# EAGLE design BSPD_v8 (EAGLE 9.5.1)

## Sheet 1 of 2
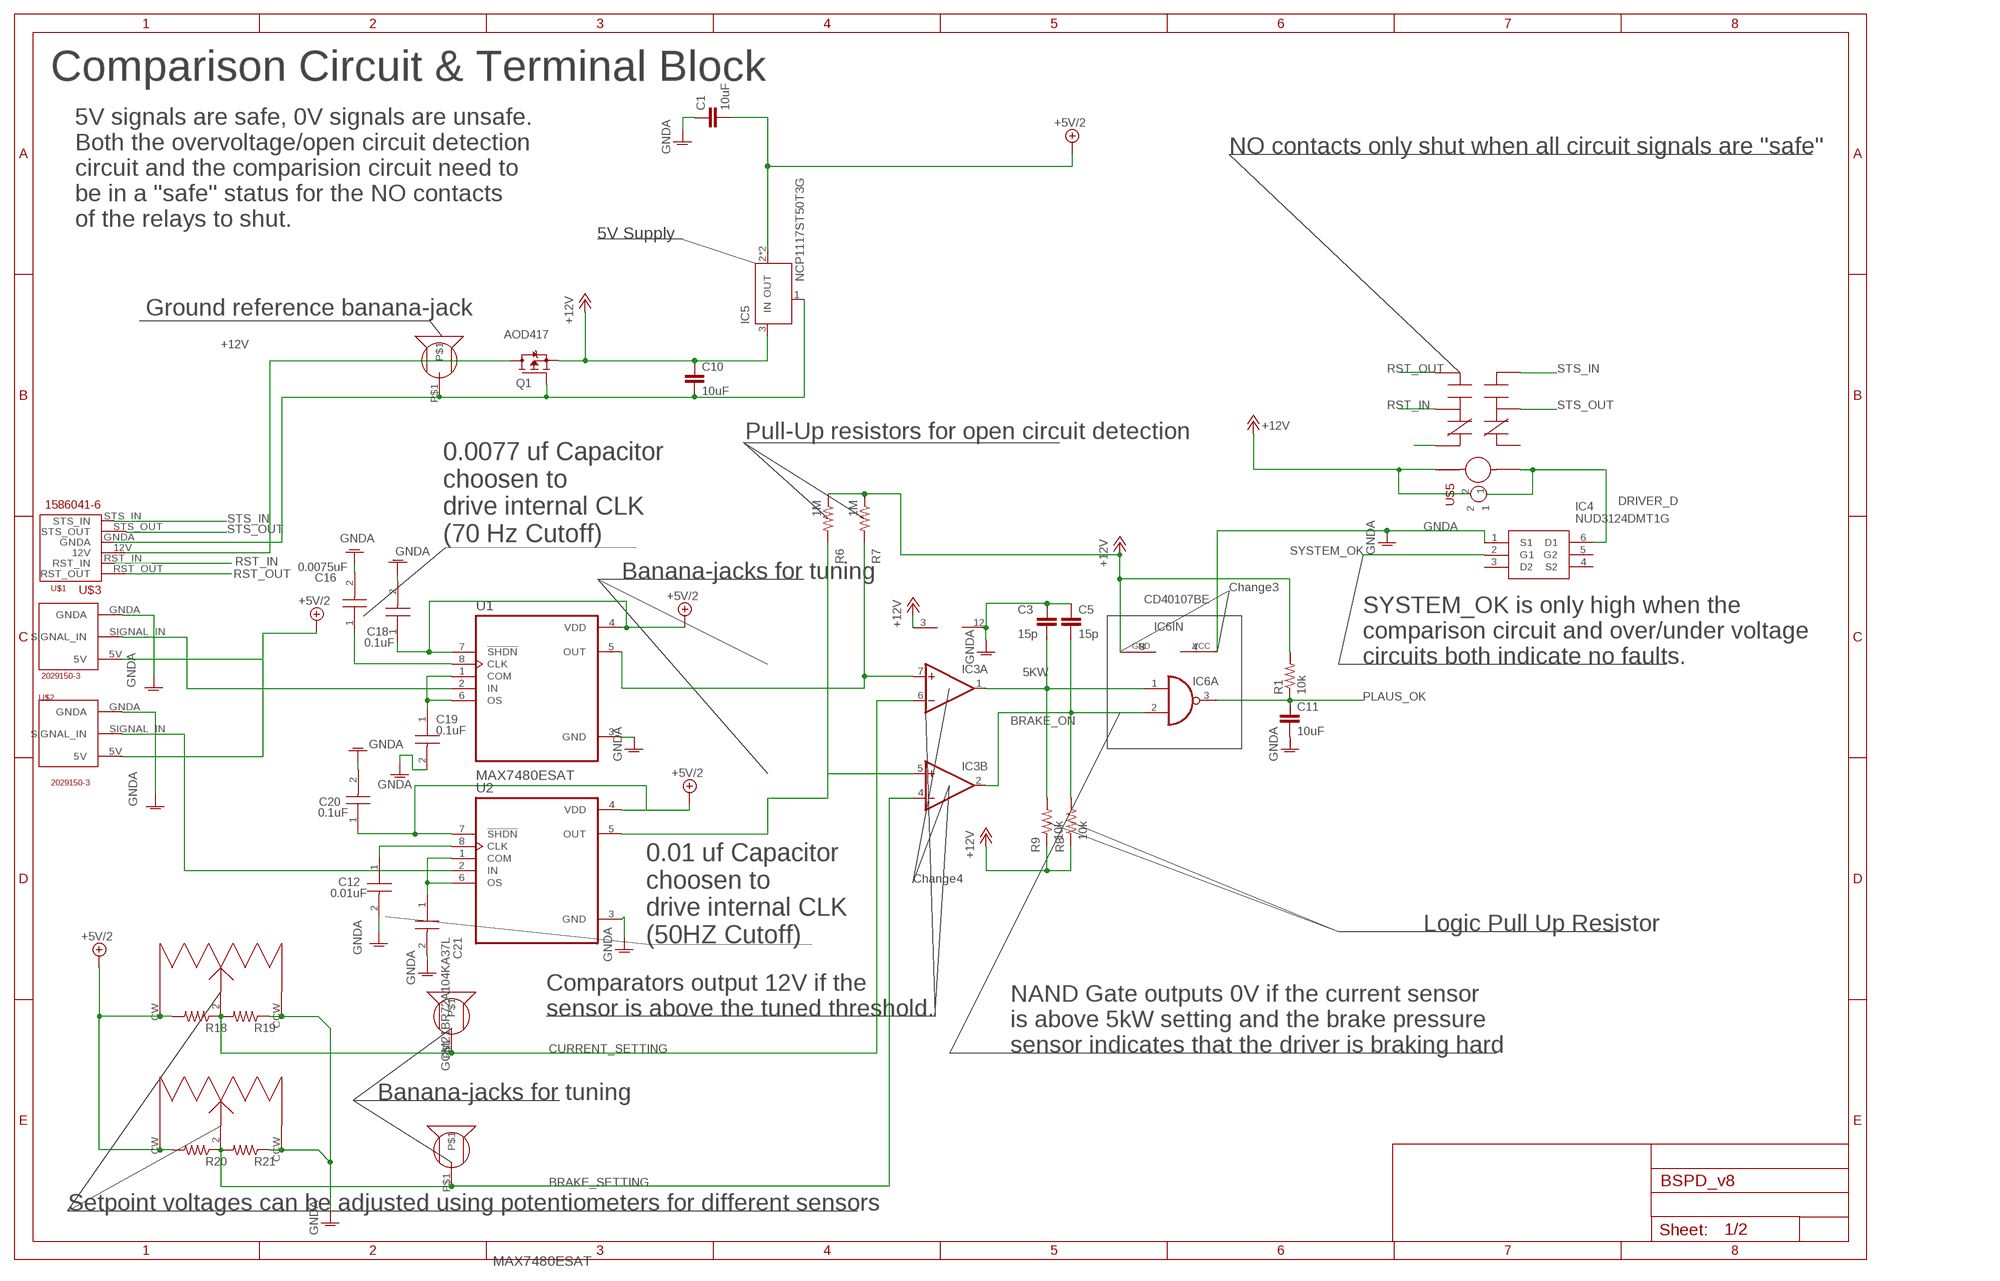
[diagram p0: schematic, sheet 1]

### Parts
C1  10uF  C-EUC0805  [C0805]
C3  15p  C-EUC0805  [C0805]
C5  15p  C-EUC0805  [C0805]
C10  10uF  C-EUC0805  [C0805]
C11  10uF  C-EUC0805  [C0805]
C12  0.01uF  GRM2195C1H103JA01D  [CAPC2012X95N]
C16  0.0075uF  GRM2195C1H752JA01D  [CAPC2012X95N]
C18  0.1uF  GCM21BR72A104KA37L  [CAPC2012X140N]
C19  0.1uF  GCM21BR72A104KA37L  [CAPC2012X140N]
C20  0.1uF  GCM21BR72A104KA37L  [CAPC2012X140N]
C21  GCM21BR72A104KA37L  [CAPC2012X140N]
IC3  4AMP_P11+7N  [DIL14]
IC4  NUD3124DMT1G  [SOT95P275X110-6N]
IC5  NCP1117ST50T3G  [SOT223]
IC6  CD40107BE  [DIL08]
Q1  AOD417  FDD4141TO252  [TO252]
R1  10k  R-US_M0805  [M0805]
R6  1M  R-US_M0805  [M0805]
R7  1M  R-US_M0805  [M0805]
R8  10k  R-US_M0805  [M0805]
R9  10k  R-US_M0805  [M0805]
R18  R-US_M0805  [M0805]
R19  R-US_M0805  [M0805]
R20  R-US_M0805  [M0805]
R21  R-US_M0805  [M0805]
U1  MAX7480ESAT  [SOIC127P600X175-8N]
U2  MAX7480ESAT  [SOIC127P600X175-8N]
U$1  2029150-3  [2029150-3]
U$2  2029150-3  [2029150-3]
U$3  1586041-6  [1586041-6]
U$4  BSPD_PARTS_MP_BANANA_PLUG  [BSPD_PARTS_BANANA_PLUG]
U$5  SSL-LX3044ID-12V  [SSL-LX3044ID-12V]
U$10  POT_3310Y-025-103L  [3310Y]
U$11  POT_3310Y-025-103L  [3310Y]
U$12  BSPD_PARTS_RLY_V23079A1001B301  [BSPD_PARTS_V23079F1101B301]
U$18  BSPD_PARTS_MP_BANANA_PLUG  [BSPD_PARTS_BANANA_PLUG]
U$19  BSPD_PARTS_MP_BANANA_PLUG  [BSPD_PARTS_BANANA_PLUG]

### Nets
5KW: C3.2 IC3.1(A:OUT) IC6.1(A:I0) R9.2
12V: Q1.3(D) U$3.12V
+5V/2: C1.2 C18.1 C20.1 IC5.2(OUT) IC5.4(OUT) R18.2 R20.2 U1.4(VDD) U1.7(!SHDN) U2.4(VDD) U2.7(!SHDN) U$1.5V U$2.5V U$10.CW U$11.CW ; also sheet 2
+12V: C10.1 IC3.3(P:V+) IC5.3(IN) IC6.8(IN:GND) Q1.2(S) R1.2 R6.1 R7.1 R8.1 R9.1 U$5.2 U$12.1 ; also sheet 2
BRAKE_ON: C5.2 IC3.2(B:OUT) IC6.2(A:I1) R8.2
BRAKE_PRES_IN: IC3.5(B:+IN) R6.2 U2.5(OUT) ; also sheet 2
BRAKE_SETTING: IC3.4(B:-IN) R20.1 R21.2 U$10.2(VO) U$19.P$1
CURRENT_IN: IC3.7(A:+IN) R7.2 U1.5(OUT) ; also sheet 2
CURRENT_SETTING: IC3.6(A:-IN) R18.1 R19.2 U$11.2(VO) U$18.P$1
DRIVER_D: IC4.6(D1) U$5.1 U$12.12
GNDA: C1.1 C3.1 C5.1 C10.2 C11.2 C12.2 C16.2 C18.2 C19.2 C20.2 C21.2 IC3.12(P:V-) IC4.1(S1) IC5.1(GND) IC6.4(IN:VCC) Q1.1(G) R19.1 R21.1 U1.3(GND) U2.3(GND) U$1.GNDA U$2.GNDA U$3.GNDA U$4.P$1 U$10.CCW U$11.CCW ; also sheet 2
N$1: U2.2(IN) U$2.SIGNAL_IN
N$2: U1.2(IN) U$1.SIGNAL_IN
N$3: U$12.3
N$4: C19.1 U1.1(COM) U1.6(OS)
N$6: C21.1 U2.1(COM) U2.6(OS)
N$7: C12.1 U2.8(CLK)
N$10: C16.1 U1.8(CLK)
PLAUS_OK: C11.1 IC6.3(A:O) R1.1 ; also sheet 2
RST_IN: U$3.RST_IN U$12.4
RST_OUT: U$3.RST_OUT U$12.5
STS_IN: U$3.STS_IN U$12.8
STS_OUT: U$3.STS_OUT U$12.9
SYSTEM_OK: IC4.2(G1) ; also sheet 2
Unconnected: IC3.8(C:-IN) IC3.9(C:+IN) IC3.10(D:-IN) IC3.11(D:+IN) IC3.13(D:OUT) IC3.14(C:OUT) IC4.3(D2) IC4.4(S2) IC4.5(G2) IC6.5(B:O) IC6.6(B:I0) IC6.7(B:I1) U$12.10

### Notes on the sheet
- Comparison Circuit & Terminal Block
- NO contacts only shut when all circuit signals are "safe"
- 5V signals are safe, 0V signals are unsafe.
  Both the overvoltage/open circuit detection
  circuit and the comparision circuit need to
  be in a "safe" status for the NO contacts
  of the relays to shut.
- 5V Supply
- Ground reference banana-jack
- Pull-Up resistors for open circuit detection
- 0.0077 uf Capacitor
  choosen to 
  drive internal CLK
  (70 Hz Cutoff)
- Banana-jacks for tuning
- Change3
- SYSTEM_OK is only high when the
  comparison circuit and over/under voltage 
  circuits both indicate no faults.
- Change4
- Logic Pull Up Resistor
- 0.01 uf Capacitor
  choosen to 
  drive internal CLK
  (50HZ Cutoff)
- Comparators output 12V if the 
  sensor is above the tuned threshold.
- NAND Gate outputs 0V if the current sensor
  is above 5kW setting and the brake pressure
  sensor indicates that the driver is braking hard
- Banana-jacks for tuning
- Setpoint voltages can be adjusted using potentiometers for different sensors

## Sheet 2 of 2
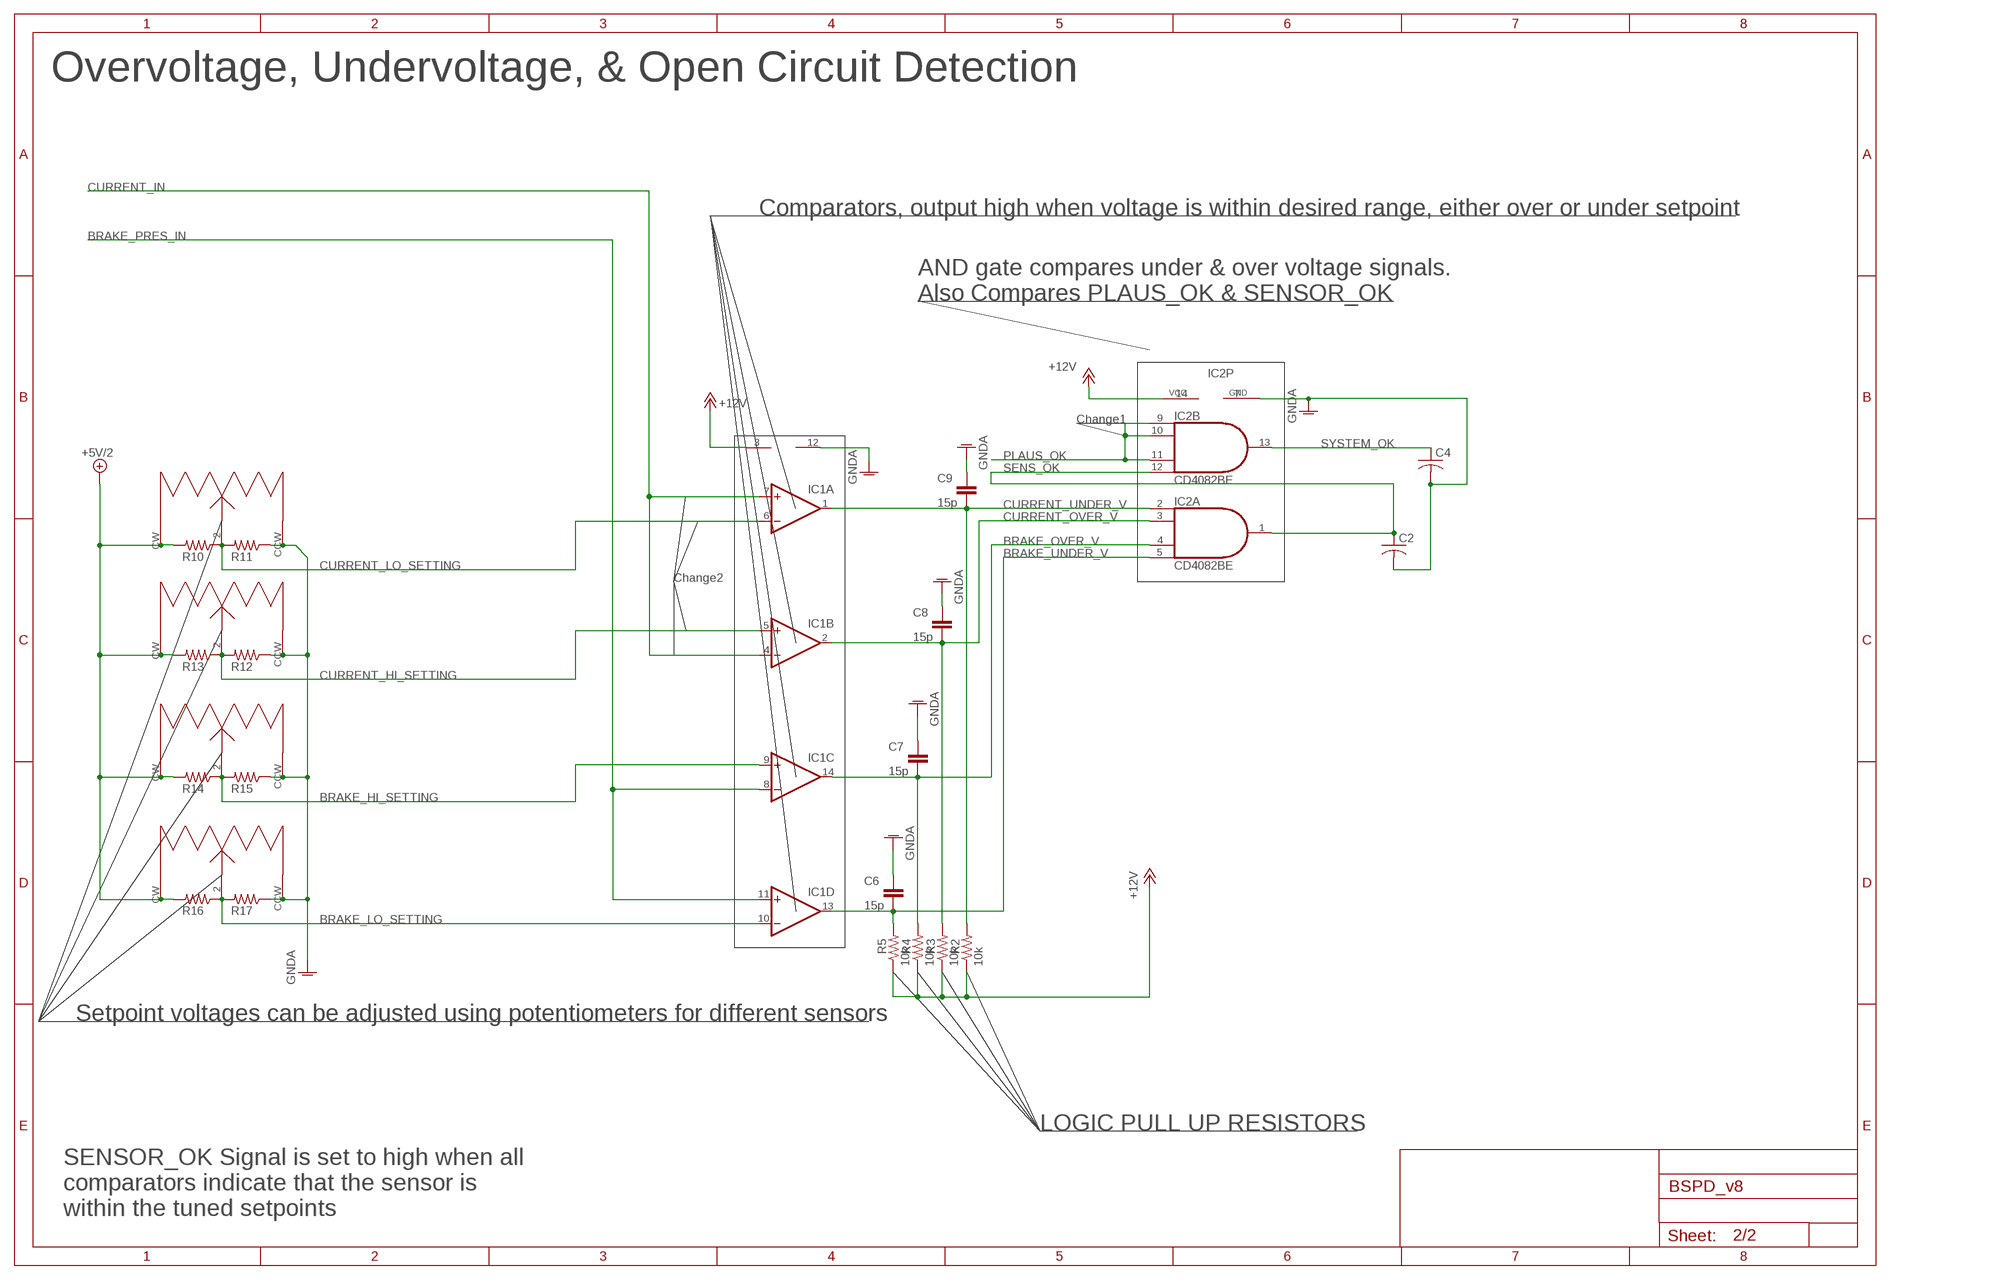
[diagram p1: schematic, sheet 2]

### Parts
C2  C-USC0805  [C0805]
C4  C-USC0805  [C0805]
C6  15p  C-EUC0805  [C0805]
C7  15p  C-EUC0805  [C0805]
C8  15p  C-EUC0805  [C0805]
C9  15p  C-EUC0805  [C0805]
IC1  4AMP_P11+7N  [DIL14]
IC2  CD4082BE  74ALS21N  [DIL14]
R2  10k  R-US_M0805  [M0805]
R3  10k  R-US_M0805  [M0805]
R4  10k  R-US_M0805  [M0805]
R5  10k  R-US_M0805  [M0805]
R10  R-US_M0805  [M0805]
R11  R-US_M0805  [M0805]
R12  R-US_M0805  [M0805]
R13  R-US_M0805  [M0805]
R14  R-US_M0805  [M0805]
R15  R-US_M0805  [M0805]
R16  R-US_M0805  [M0805]
R17  R-US_M0805  [M0805]
U$6  POT_3310Y-025-103L  [3310Y]
U$7  POT_3310Y-025-103L  [3310Y]
U$8  POT_3310Y-025-103L  [3310Y]
U$9  POT_3310Y-025-103L  [3310Y]

### Nets
+5V/2: R10.2 R13.2 R14.2 R16.2 U$6.CW U$7.CW U$8.CW U$9.CW ; also sheet 1
+12V: IC1.3(P:V+) IC2.14(P:VCC) R2.1 R3.1 R4.1 R5.1 ; also sheet 1
BRAKE_HI_SETTING: IC1.9(C:+IN) R14.1 R15.2 U$8.2(VO)
BRAKE_LO_SETTING: IC1.10(D:-IN) R16.1 R17.2 U$9.2(VO)
BRAKE_OVER_V: C7.2 IC1.14(C:OUT) IC2.4(A:I2) R4.2
BRAKE_PRES_IN: IC1.8(C:-IN) IC1.11(D:+IN) ; also sheet 1
BRAKE_UNDER_V: C6.2 IC1.13(D:OUT) IC2.5(A:I3) R5.2
CURRENT_HI_SETTING: IC1.5(B:+IN) R12.2 R13.1 U$7.2(VO)
CURRENT_IN: IC1.4(B:-IN) IC1.7(A:+IN) ; also sheet 1
CURRENT_LO_SETTING: IC1.6(A:-IN) R10.1 R11.2 U$6.2(VO)
CURRENT_OVER_V: C8.2 IC1.2(B:OUT) IC2.3(A:I1) R3.2
CURRENT_UNDER_V: C9.2 IC1.1(A:OUT) IC2.2(A:I0) R2.2
GNDA: C2.2 C4.2 C6.1 C7.1 C8.1 C9.1 IC1.12(P:V-) IC2.7(P:GND) R11.1 R12.1 R15.1 R17.1 U$6.CCW U$7.CCW U$8.CCW U$9.CCW ; also sheet 1
PLAUS_OK: IC2.9(B:I0) IC2.10(B:I1) IC2.11(B:I2) ; also sheet 1
SENS_OK: C2.1 IC2.1(A:O) IC2.12(B:I3)
SYSTEM_OK: C4.1 IC2.13(B:O) ; also sheet 1

### Notes on the sheet
- Overvoltage, Undervoltage, & Open Circuit Detection
- Comparators, output high when voltage is within desired range, either over or under setpoint
- AND gate compares under & over voltage signals.
  Also Compares PLAUS_OK & SENSOR_OK
- Change1
- Change2
- Setpoint voltages can be adjusted using potentiometers for different sensors
- LOGIC PULL UP RESISTORS
- SENSOR_OK Signal is set to high when all 
  comparators indicate that the sensor is 
  within the tuned setpoints

## Library data of the parts
C1 C10 C11 = resistor:C-EU: CAPACITOR, European symbol
C2 C4 = rcl:C-US: CAPACITOR, American symbol; SPICEPREFIX: C
C3 C5-C9 = rcl:C-EU: CAPACITOR, European symbol; SPICEPREFIX: C
C12 = SamacSys_Parts:GRM2195C1H103JA01D: Murata 0805 GRM 10nF Ceramic Multilayer Capacitor, 50 V dc, +125C, C0G Dielectric, +/-5% SMD Source: Datasheet <https://componentsearchengine.com/Datasheets/1/GRM2195C1H103JA01D.pdf>; DESCRIPTION: Murata 0805 GRM 10nF Ceramic Multilayer Capacitor, 50 V dc, +125C, C0G Dielectric, +/-5% SMD; HEIGHT: 0.95mm; MANUFACTURER_NAME: Murata Electronics; MANUFACTURER_PART_NUMBER: GRM2195C1H103JA01D; MOUSER_PART_NUMBER: 81-GRM215C1H103JA01D; MOUSER_PRICE-STOCK: https://www.mouser.com/Search/Refine.aspx?Keyword=81-GRM215C1H103JA01D
C16 = SamacSys_Parts:GRM2195C1H752JA01D: Murata 0805 GRM 7.5nF Ceramic Multilayer Capacitor, 50 V, +125C, C0G Dielectric, +/-5% SMD Source: Datasheet <https://componentsearchengine.com/Datasheets/1/GRM2195C1H752JA01D.pdf>; DESCRIPTION: Murata 0805 GRM 7.5nF Ceramic Multilayer Capacitor, 50 V, +125C, C0G Dielectric, +/-5% SMD; HEIGHT: 0.95mm; MANUFACTURER_NAME: Murata Electronics; MANUFACTURER_PART_NUMBER: GRM2195C1H752JA01D; MOUSER_PART_NUMBER: 81-GRM2195C1H752JA1D; MOUSER_PRICE-STOCK: https://www.mouser.com/Search/Refine.aspx?Keyword=81-GRM2195C1H752JA1D
C18-C21 = SamacSys_Parts:GCM21BR72A104KA37L: Ceramic SMT capacitor 100nF 100Vdc Murata 100nF Multilayer Ceramic Capacitor (MLCC) 100 V dc +/-10% X7R dielectric GCM Surface Mount max op. temp. +125C Source: Datasheet <https://componentsearchengine.com/Datasheets/1/GCM21BR72A104KA37L.pdf>; DESCRIPTION: Ceramic SMT capacitor 100nF 100Vdc Murata 100nF Multilayer Ceramic Capacitor (MLCC) 100 V dc +/-10% X7R dielectric GCM Surface Mount max op. temp. +125C; HEIGHT: 1.4mm; MANUFACTURER_NAME: Murata Electronics; MANUFACTURER_PART_NUMBER: GCM21BR72A104KA37L; MOUSER_PART_NUMBER: 81-GCM21BR72A104KA7L; MOUSER_PRICE-STOCK: https://www.mouser.com/Search/Refine.aspx?Keyword=81-GCM21BR72A104KA7L
IC1 IC3 = BSPD_REV6:4AMP_P11+7: OP AMP
IC2 = BSPD_REV6:74*21: Dual 4-input AND gate
IC4 = SamacSys_Parts:NUD3124DMT1G: Automotive Inductive Load Driver Source: Datasheet <https://componentsearchengine.com/Datasheets/1/NUD3124DMT1G.pdf>; DESCRIPTION: Automotive Inductive Load Driver; HEIGHT: 1.1mm; MANUFACTURER_NAME: ON Semiconductor; MANUFACTURER_PART_NUMBER: NUD3124DMT1G; MOUSER_PART_NUMBER: 863-NUD3124DMT1G
IC5 = BSPD_REV6:NCP1117ST50T3G
IC6 = BSPD_REV6:CD40107BE
Q1 = AOD417:FDD4141: P-Channel PowerTrench® MOSFET Source: FDD4141.pdf; AVAILABILITY: Unavailable; DESCRIPTION: Transistor: P-MOSFET; unipolar; -40V; -50A; 69W; DPAK; MF: ON Semiconductor; MP: FDD4141; PACKAGE: TO-252-3 Fairchild Semiconductor; PRICE: None
R1 = rcl:R-US_: RESISTOR, American symbol; SPICEPREFIX: R
R2-R21 = resistor:R-US_: RESISTOR, American symbol
U1 U2 = MAX7480ESAT:MAX7480ESAT; DESCRIPTION: Active Filter Single SW-CAP Low Pass 8th Order 2kHz 8-Pin SOIC N; DIGI-KEY_PART_NUMBER: MAX7480ESA+-ND; DIGI-KEY_PURCHASE_URL: https://www.digikey.com/product-detail/en/maxim-integrated/MAX7480ESA-/MAX7480ESA--ND/1513397?utm_source=snapeda&utm_medium=aggregator&utm_campaign=symbol; MF: Maxim Integrated; MP: MAX7480ESA+; PACKAGE: SOIC-8 Maxim
U$1 U$2 = WM21358-ND:2029150-3
U$3 = WM21358-ND:1586041-6
U$4 U$18 U$19 = BSPD_v4:BSPD_PARTS_MP_BANANA_PLUG
U$5 = 67-1067-ND:SSL-LX3044ID-12V
U$6-U$11 = BSPD_PARTS:POT_3310Y-025-103L
U$12 = BSPD_v4:BSPD_PARTS_RLY_V23079A1001B301

## Net classes
0 default: width 0.3 mm, drill 0.2 mm, clearance 0.2 mm

## Board
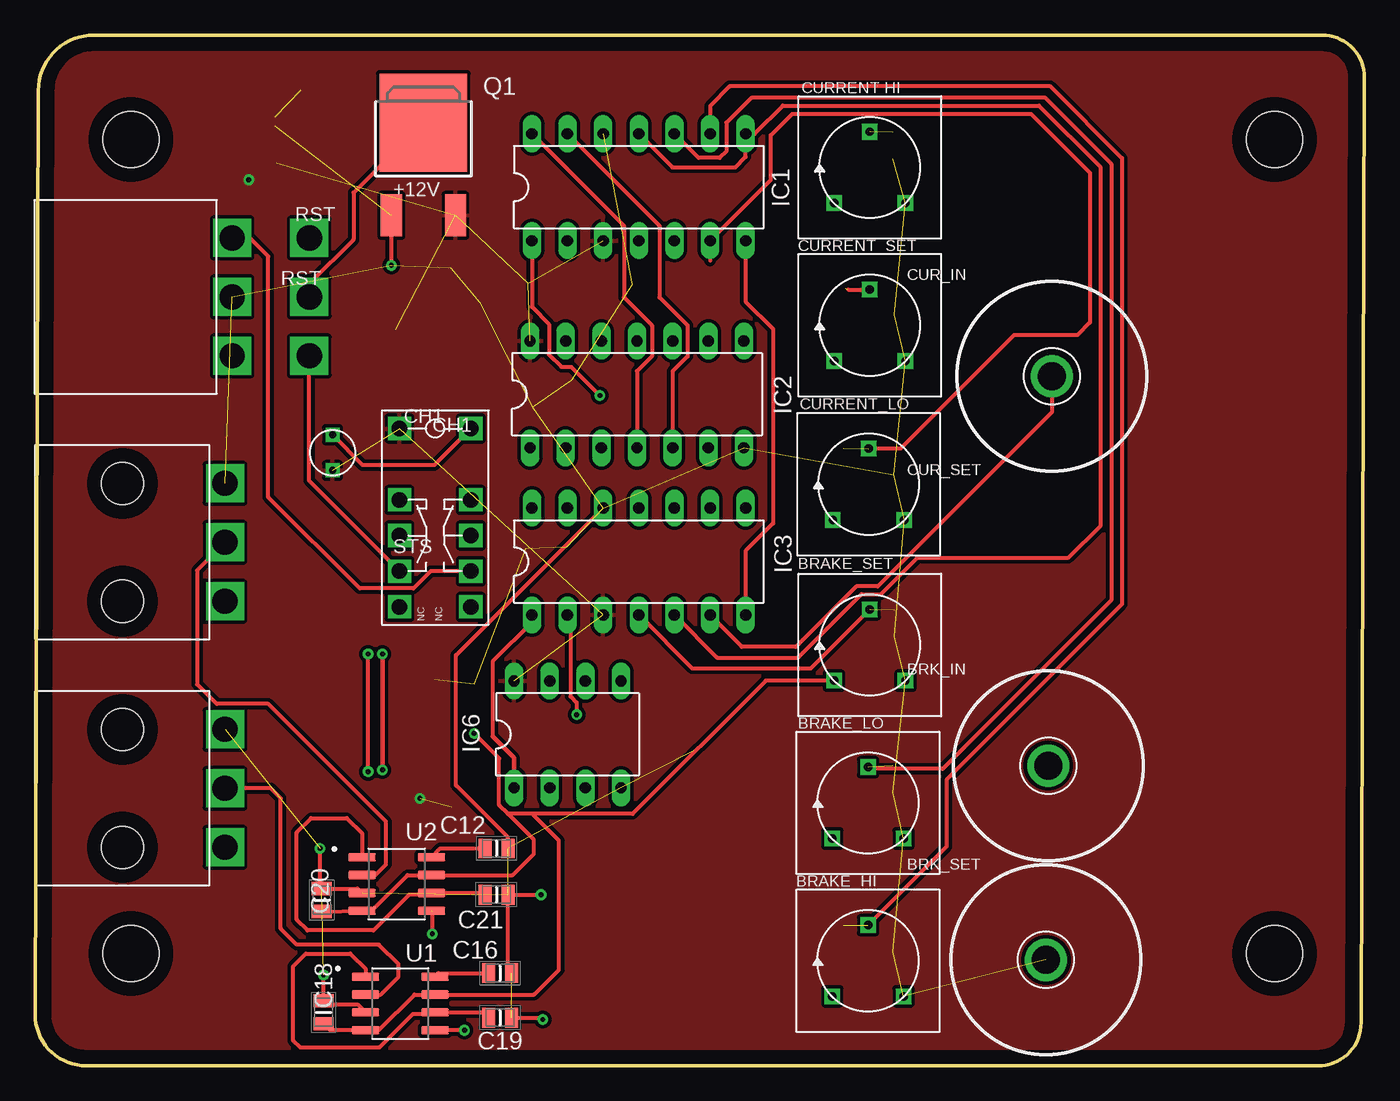
[diagram p2: board, top side]
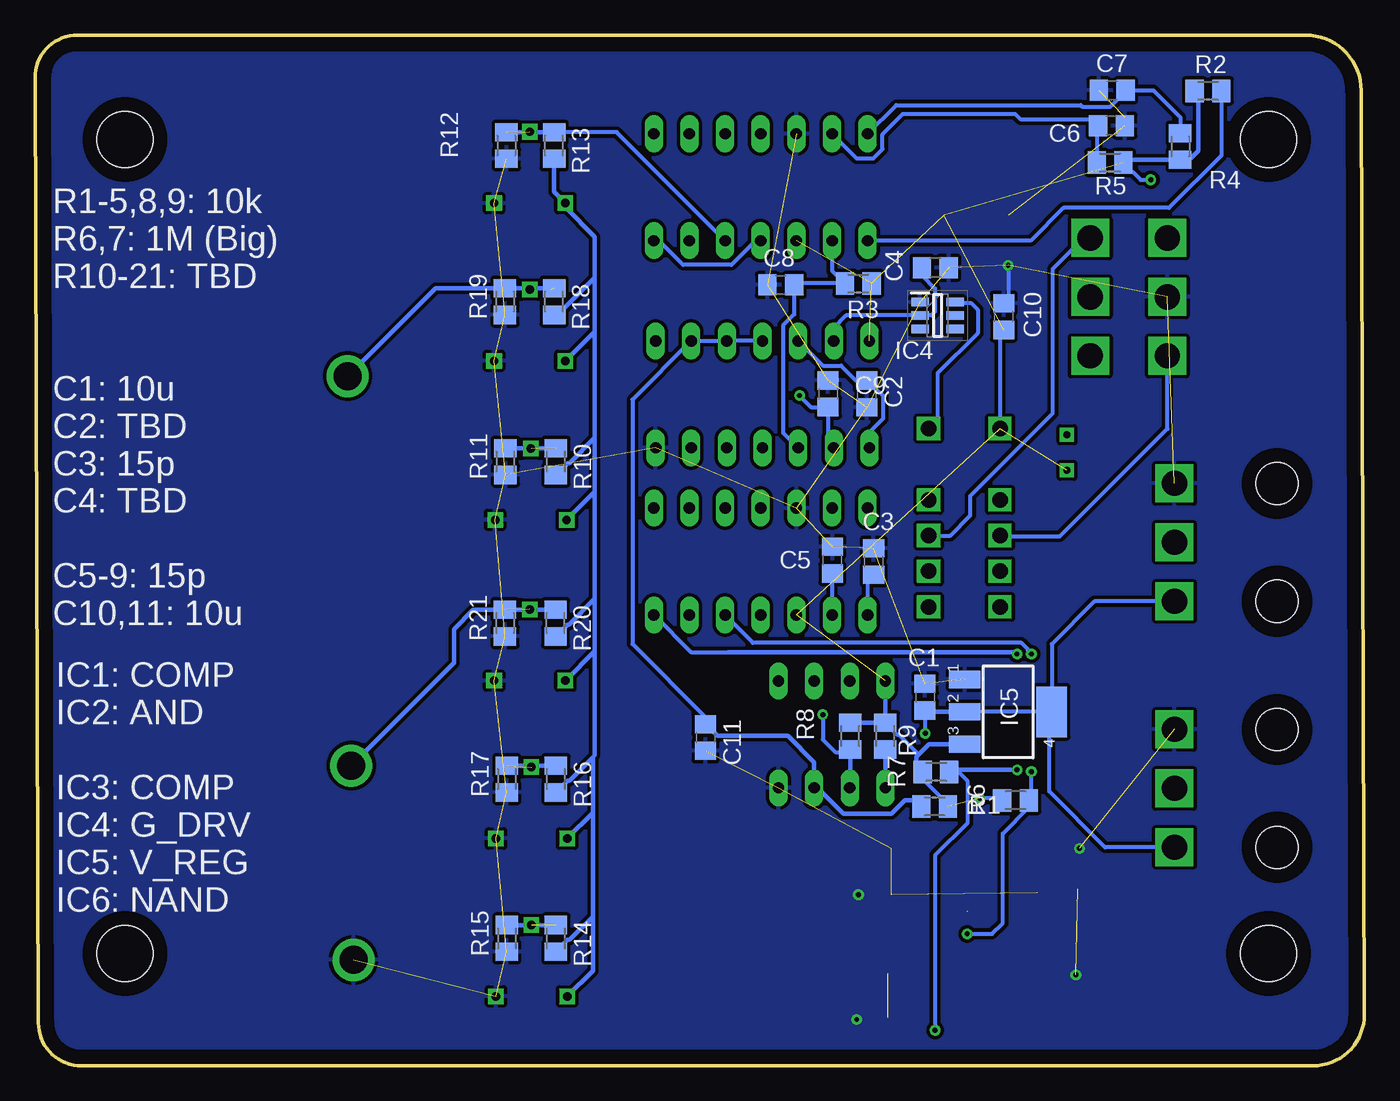
[diagram p3: board, bottom side, seen from below]

Size 94.73 x 73.43 mm. Coordinates in mm from the lower left corner, seen from the top.
Outline: 91.71,73.43 4.19,73.43 arc90 0.23,69.48 0,3.67 arc90 3.66,0 91.42,0 arc90 94.5,3.06 94.73,70.4 arc90 91.71,73.43
Copper layers (1*16): Top 0.035mm / dielectric 1.5mm / Bottom 0.035mm
Design rules "default *": minimum track width 6mil, minimum drill 0.35mm, track to track 10mil, track to pad 10mil, pad to pad 10mil, via to via 10mil, smd to smd 10mil, copper to edge 40mil, drill to drill 10mil, minimum pad ring 10mil, minimum via ring 8mil, stop-mask expansion 4mil, vias tented up to drill 0mil, thermal gap 10mil
Holes 4 mm at 6.84,66 6.84,8 88.34,66 88.34,8

### Footprints (pad centres in the part's own frame; a part is rotated, then mirrored left to right if it is on the bottom)
C0805 = smd 1.3 x 1.5: 1 -0.95,0; 2 0.95,0
CAPC2012X95N = smd 0.91 x 1.39: 1 -0.82,0; 2 0.82,0
CAPC2012X140N = smd 0.94 x 1.43: 1 -0.82,0; 2 0.82,0
DIL14 = drill 0.813 long: 1 -7.62,-3.81; 2 -5.08,-3.81; 3 -2.54,-3.81; 4 0,-3.81; 5 2.54,-3.81; 6 5.08,-3.81; 7 7.62,-3.81; 8 7.62,3.81; 9 5.08,3.81; 10 2.54,3.81; 11 0,3.81; 12 -2.54,3.81; 13 -5.08,3.81; 14 -7.62,3.81
SOT95P275X110-6N = smd 1.25 x 0.6: 1 -1.25,0.95; 2 -1.25,0; 3 -1.25,-0.95; 4 1.25,-0.95; 5 1.25,0; 6 1.25,0.95
SOT223 = smd 1.219 x 2.235: 1 -2.311,-3.099; 2 0,-3.099; 3 2.311,-3.099 | smd 3.6 x 2.2: 4 0,3.099
DIL08 = drill 0.813 long: 1 -3.81,-3.81; 2 -1.27,-3.81; 3 1.27,-3.81; 4 3.81,-3.81; 5 3.81,3.81; 6 1.27,3.81; 7 -1.27,3.81; 8 -3.81,3.81
TO252 = smd 1.5 x 3: 1 -2.286,-6.6; 2 2.28,-6.6 | smd 6.25 x 7: 3 0,0
M0805 = smd 1.3 x 1.6: 1 -0.95,0; 2 0.95,0
SOIC127P600X175-8N = smd 1.97 x 0.59: 1 -2.475,1.905; 2 -2.475,0.635; 3 -2.475,-0.635; 4 -2.475,-1.905; 5 2.475,-1.905; 6 2.475,-0.635; 7 2.475,0.635; 8 2.475,1.905
2029150-3 = drill 1.8 square: 5V 11.1,13.55; GNDA 2.7,13.55; SIGNAL_IN 6.9,13.55 | hole 3: 2.7,6.25; 11.1,6.25
1586041-6 = drill 1.8 square: 12V 6.9,-6.6; GNDA 6.9,-1.1; RST_IN 2.7,-1.1; RST_OUT 2.7,-6.6; STS_IN 11.1,-1.1; STS_OUT 11.1,-6.6
BSPD_PARTS_BANANA_PLUG = drill 2 pad 3: P$1 0,0
SSL-LX3044ID-12V = drill 0.5 square: 1 1.27,0; 2 -1.27,0
3310Y = drill 0.6 square: 2 2.54,5.08; CCW 5.08,0; CW 0,0
BSPD_PARTS_V23079F1101B301 = drill 1.1 square: 1 0,0; 3 5.08,0; 4 7.62,0; 5 10.16,0; 6 12.7,0; 7 12.7,5.08; 8 10.16,5.08; 9 7.62,5.08; 10 5.08,5.08; 12 0,5.08

### Placement (x,y rotation side)
C1  31.31,26.27 270 bottom
C2  35.46,47.87 270 bottom
C3  34.97,35.93 270 bottom
C4  30.58,56.85 0 bottom
C5  37.92,36.03 270 bottom
C6  18.02,66.98 180 bottom
C7  17.97,69.49 0 bottom
C8  41.59,55.63 0 bottom
C9  38.21,47.88 270 bottom
C10  25.7,53.38 90 bottom
C11  46.95,23.39 270 bottom
C12  32.88,15.49 0 top
C16  33.13,6.6 0 top
C18  20.56,3.81 90 top
C19  33.13,3.43 0 top
C20  20.43,11.81 90 top
C21  32.88,12.19 0 top
IC1  43.02,62.59 0 top
IC2  42.89,47.84 0 top
IC3  43.02,35.93 0 top
IC4  30.42,53.45 0 bottom
IC5  25.39,25.21 270 bottom
IC6  37.94,23.62 0 top
Q1  27.67,67.18 0 top
R1  30.62,18.47 0 bottom
R2  11.15,69.45 0 bottom
R3  36.07,55.73 180 bottom
R4  13.12,65.49 90 bottom
R5  18.12,64.35 180 bottom
R6  24.86,18.92 0 bottom
R7  30.53,20.94 0 bottom
R8  36.64,23.49 270 bottom
R9  34.14,23.49 270 bottom
R10  57.62,43.04 270 bottom
R11  61.22,43.04 90 bottom
R12  61.14,65.56 90 bottom
R13  57.74,65.56 270 bottom
R14  57.62,9.08 270 bottom
R15  61.12,9.08 90 bottom
R16  57.62,20.42 270 bottom
R17  61.12,20.42 90 bottom
R18  57.74,54.44 270 bottom
R19  61.24,54.44 90 bottom
R20  57.64,31.54 270 bottom
R21  61.24,31.54 90 bottom
U1  26.02,4.45 0 top
U2  25.77,12.95 0 top
U$1  -0.01,26.67 270 top
U$2  -0.01,44.2 270 top
U$3  12.94,47.88 90 top
U$4  72.04,7.54 0 top
U$5  21.2,43.69 90 top
U$6  56.86,38.89 0 top
U$7  56.94,61.46 0 top
U$8  56.82,4.95 0 top
U$9  56.82,16.2 0 top
U$10  56.94,27.44 0 top
U$11  56.94,50.22 0 top
U$12  25.97,45.4 270 top
U$18  72.45,49.13 0 top
U$19  72.2,21.39 0 top

### Tracks (layer width: path | path; a pad name or v marks a point on that pad's centre or on a via)
5KW
  Top 0.3: IC3.1 35.4,31.6 32.61,28.81 32.61,23.48
  Top 0.305: 32.61,23.48 34.13,21.95 IC6.1
  Bottom 0.3: C3.2 35.4,34.55 IC3.1
  Bottom 0.305: R9.2 IC6.1
12V
  Top 0.3: Q1.3 22.69,62.2 22.69,58.86 19.54,55.71 U$3.12V
+5V/2  (via drill 0.35)
  Top 0.3: U$10.CW 52.07,27.44 42.58,17.96 35.42,17.96 | 33.69,17.96 33.07,18.58 33.07,21.91 v31.29,23.69 | 35.42,17.96 33.69,17.96 | 33.69,17.96 35.55,16.1 35.55,15.11 34.02,13.59 U2.7 26.53,13.59 23.99,11.05 U2.4 C20.1 | C18.1 21.01,2.54 U1.4 24.5,2.54 27.04,5.08 U1.7 35.55,5.08 37.33,6.86 37.33,16.05 35.42,17.96
  Bottom 0.3: v31.29,23.69 31.29,25.3 C1.2 | 22.47,25.21 IC5.4 22.29,30.04 19.23,33.1 U$2.5V | 22.47,25.21 IC5.2 | U$1.5V 18.49,15.57 22.47,19.55 22.47,25.21
  Bottom 0.305: R13.2 57.74,62.26 U$7.CW 56.94,61.15 54.85,59.05 54.85,56.13 | 54.85,56.13 54.85,52.31 | 54.85,52.31 54.85,44.73 | 57.59,53.34 R18.2 57.49,53.49 54.85,56.13 | IC5.2 31.2,25.21 C1.2 | R10.2 56.77,42.94 56.65,42.94 54.85,44.73 | R20.2 56.8,31.44 56.67,31.44 54.85,33.26 | 54.85,44.73 54.85,40.89 | 54.85,40.89 54.85,33.26 | R16.2 56.77,20.32 56.65,20.32 54.99,21.98 | 54.85,33.26 54.85,29.53 | 54.85,29.53 54.85,22.11 54.99,21.98 | R14.2 56.77,8.97 56.65,8.97 54.99,10.63 | 54.99,21.98 54.99,18.03 | 54.99,18.03 54.99,10.63 | U$11.CW 54.85,52.31 | U$6.CW 54.85,40.89 | U$10.CW 54.85,29.53 | U$9.CW 54.99,18.03 | U$8.CW 54.99,6.78 54.99,10.63
+12V  (via drill 0.35)  (9 unrouted)
  Bottom 0.3: 13.12,64.66 R4.1 | 16.99,64.54 R5.1 15.94,63.12 v15.23,63.12 | C10.1 25.97,52.16 U$12.1 | R1.2 29.67,18.64 31.48,20.45 R7.1 | R9.1 33.3,23.6 33.18,23.6 31.91,22.33 31.91,21.36 | R6.1 25.94,19.05 v27.42,19.05
  Bottom 0.305: 16.99,64.54 R4.1 12.49,64.54 11.85,65.18 11.85,68.94 12.1,69.19 R2.1 | IC6.8 34.13,24.45 R9.1 R8.1 | R7.1 31.91,21.36 31.91,22.03 31.04,22.9 IC5.3
  pour Top: 0.03,72.92 104.72,72.92 104.31,-1.01 2.23,-1.01 0.03,2.89
BRAKE_HI_SETTING  (1 unrouted)
  Top 0.3: U$8.2 64.94,15.62 64.94,20.38 77.46,32.89 77.46,64.66 72.35,69.77 49.5,69.77 48.1,68.37 IC1.9
  Bottom 0.305: R14.1 R15.2
BRAKE_LO_SETTING  (1 unrouted)
  Top 0.3: U$9.2 59.48,21.15 64.69,21.15 76.7,33.15 76.7,64.26 72,68.96 51.04,68.96 49.26,67.19 49.26,65.15 48.79,64.67 47.29,64.67 IC1.10
  Bottom 0.305: R16.1 R17.2
BRAKE_ON  (via drill 0.35)
  Top 0.3: v38.6,25.02 38.6,25.88 38.15,26.33 38.15,31.91 IC3.2
  Bottom 0.3: C5.2 37.94,35.06 IC3.2 | 36.64,22.35 37.71,22.35 38.6,23.24 v38.6,25.02
  Bottom 0.305: R8.2 36.64,22.35 36.64,19.84 IC6.2
BRAKE_OVER_V
  Top 0.3: IC1.14 41.96,59.84 41.96,54.75 43.96,52.75 43.96,50.55 42.89,49.48 IC2.4
  Bottom 0.3: R4.2 13.12,67.58 15.03,69.49 C7.2 17.02,69.42 18.11,68.34 20.12,68.34 20.23,68.44 33.36,68.44 IC1.14
BRAKE_PRES_IN  (via drill 0.35)  (1 unrouted)
  Top 0.3: v23.74,20.95 v23.74,29.34 | IC1.11 45.41,64.01 49.9,64.01 50.64,64.75 IC1.8 51.27,66.4 53.28,68.41 71.53,68.41 75.93,64.01 75.93,38.48 73.65,36.2 62.87,36.2 60.29,33.61 58.89,33.61 54.36,29.08 48.59,29.08 IC3.5 | 28.31,10.98 v28.31,9.4
  Bottom 0.3: v23.74,20.95 23.74,19.09 R6.2 23.91,18.41 25.77,16.55 25.77,10.16 26.53,9.4 v28.31,9.4 | v23.74,29.34 23.97,29.57 23.97,29.66 24.45,30.14 43.58,30.14 IC3.5
BRAKE_SETTING  (1 unrouted)
  Top 0.3: IC3.4 46.82,28.32 55.28,28.32 U$10.2
  Bottom 0.305: R20.1 R21.2 63.51,32.49 64.88,31.11 64.88,28.7 U$19.P$1
BRAKE_UNDER_V
  Top 0.3: IC1.13 44.5,59.84 44.5,54.75 46.5,52.75 46.5,50.55 45.43,49.48 IC2.5
  Bottom 0.3: R5.2 19.07,66.88 C6.2 19.43,67.44 24.53,67.44 24.9,67.81 32.89,67.81 34.34,66.36 34.34,65.3 34.99,64.64 36.18,64.64 IC1.13
CURRENT_HI_SETTING  (1 unrouted)
  Bottom 0.3: IC1.5 53.29,66.51 R13.1
  Bottom 0.305: R13.1 R12.2
CURRENT_IN  (via drill 0.35)
  Top 0.3: IC1.7 50.64,54.45 52.59,52.49 52.59,38.64 50.64,36.68 IC3.7 | v30.59,2.54 U1.5
  Top 0.305: v24.75,29.34 v24.75,21.08
  Bottom 0.3: R7.2 28.92,20.94 28.31,20.32 28.31,17.27 30.59,14.99 v30.59,2.54 | IC1.4 43.39,58.78 45.12,57.05 48.54,57.05 50.27,58.78 IC1.7 | IC3.7 47.99,29.46 45.32,29.46
  Bottom 0.305: 45.32,29.46 24.88,29.46 v24.75,29.34 | v24.75,21.08 29.44,21.08 R7.2
CURRENT_LO_SETTING  (1 unrouted)
  Top 0.3: 48.11,57.37 48.11,58.77 IC1.6 52.44,63.12 52.44,66.29 53.96,67.82 70.97,67.82 75.17,63.62 75.17,52.96 74.27,52.05 69.76,52.05 61.67,43.97 U$6.2
  Bottom 0.305: R10.1 R11.2
CURRENT_OVER_V
  Bottom 0.3: IC2.3 41.42,45.09 41.42,52.75 40.64,53.53 C8.2 40.54,55.73 R3.2 37.94,56.66 IC1.2
CURRENT_SETTING  (1 unrouted)
  Top 0.3: 57.95,55.3 U$11.2 | U$18.P$1 72.45,46.55 60.06,34.16 58.53,34.16 54.21,29.84 50.37,29.84 IC3.6
  Bottom 0.305: U$18.P$1 66.19,55.39 R19.2 R18.1
CURRENT_UNDER_V  (via drill 0.35)
  Top 0.3: v40.25,47.75 38.2,49.8 37.5,49.8 36.62,50.67 36.62,52.85 35.4,54.07 IC1.1
  Bottom 0.3: IC2.2 38.21,44.43 C9.2 39.42,46.93 v40.25,47.75 | R2.2 10.2,64.84 13.93,61.11 21.44,61.11 23.77,58.78 IC1.1
DRIVER_D
  Top 0.3: U$12.12 28.45,42.8 23.36,42.8 U$5.1
  Bottom 0.3: U$12.12 30.41,46.03 30.41,49.33 27.55,52.2 27.55,53.85 28.05,54.36 29.12,54.36 IC4.6
GNDA  (via drill 0.35)  (36 unrouted)
  Top 0.3: U2.3 22.98,12.63 C20.2 20.31,12.76 v20.31,15.49 | U1.3 22.98,4.38 20.79,4.38 20.56,4.61 C18.2 v20.56,6.48 | Q1.1 v25.39,57.02 | C16.2 33.7,6.86 C21.2 v36.06,12.19 | C12.2 33.7,16.28 30,19.98 30,29.26 IC3.12 | C19.2 36.06,3.43 v36.18,3.3
  Bottom 0.3: C6.1 17.07,67.58 | v25.39,57.02 25.39,54.64 C10.2
  pour Bottom: -3.01,72.87 102.99,72.87 102.99,-2 -1.01,-2 -3.01,0
N$1
  Top 0.3: U$2.SIGNAL_IN 11.54,35.3 11.54,27.18 12.94,25.78 16.62,25.78 25.01,17.4 25.01,14.35 24.24,13.59 U2.2
N$2
  Top 0.3: U1.2 24.63,5.08 25.9,6.35 25.9,7.24 24.5,8.64 18.66,8.64 17.51,9.78 17.51,19.05 16.79,19.77 U$1.SIGNAL_IN
N$4
  Top 0.3: C19.1 31.93,3.81 U1.6 28.37,3.68 26.91,3.68 24.52,1.29 18.91,1.29 18.4,1.8 18.4,7.11 19.29,8 22.47,8 23.55,6.92 U1.1
N$6
  Top 0.3: C21.1 31.93,12.32 U2.6 28.12,12.19 26.66,12.19 24.12,9.65 19.42,9.65 18.66,10.41 18.66,16.64 19.67,17.65 22.21,17.65 23.29,16.57 U2.1
N$7
  Top 0.3: U2.8 28.88,15.49 C12.1
N$10
  Top 0.3: U1.8 28.75,6.6 C16.1
PLAUS_OK
  Bottom 0.3: C11.1 46.95,24.85 52.16,30.06 52.16,47.46 IC2.9 IC2.10 IC2.11
  Bottom 0.305: C11.1 46.11,23.5 41.08,23.5 39.21,21.63 IC6.3 38.97,19.81 37.12,17.95 33.69,17.95 32.73,18.92 32.02,18.92 R1.1
RST_IN
  Bottom 0.3: 25.75,37.56 U$12.4 25.91,37.72 21.7,37.72 14.04,45.38 U$3.RST_IN
RST_OUT
  Top 0.3: U$12.5 19.54,41.67 U$3.RST_OUT
SENS_OK
  Bottom 0.3: IC2.12 38.59,49.88 37.3,49.88 36.23,48.82 C2.1 34.61,47.97 34.54,47.97 34.3,47.73 34.3,46.1 35.27,45.13 IC2.1
STS_IN
  Top 0.3: U$12.8 28.19,35.24 26.96,34.01 23.13,34.01 16.62,40.51 16.62,57.66 15.3,58.98 U$3.STS_IN
STS_OUT
  Bottom 0.3: U$3.STS_OUT 20,58.98 22.21,56.77 22.21,46.48 28.09,40.61 28.09,39.21 29.52,37.78 U$12.9
SYSTEM_OK
  Bottom 0.3: IC2.13 37.81,52.59 36.94,53.45 IC4.2 30.86,53.45 30.59,53.72 30.59,55.37 31.53,56.3 C4.1

### Text on the board
tPlace: CURRENT HI | +12V | RST | CURRENT_SET | RST | CUR_IN | CURRENT_LO | CH1 | CH1 | CUR_SET | STS | BRAKE_SET | BRK_IN | BRAKE_LO | BRK_SET | BRAKE_HI
bPlace: R1-5,8,9: 10k / R6,7: 1M (Big) / R10-21: TBD / / / C1: 10u / C2: TBD / C3: 15p / C4: TBD / / C5-9: 15p / C10,11: 10u | IC1: COMP / IC2: AND / / IC3: COMP / IC4: G_DRV / IC5: V_REG / IC6: NAND
tTest: CUT HERE | CUT HERE | CUT HERE | CUT HERE
bTest: CUT HERE | CUT HERE | CUT HERE | CUT HERE